# Altium schematic sheet ADC.SchDoc
size A4
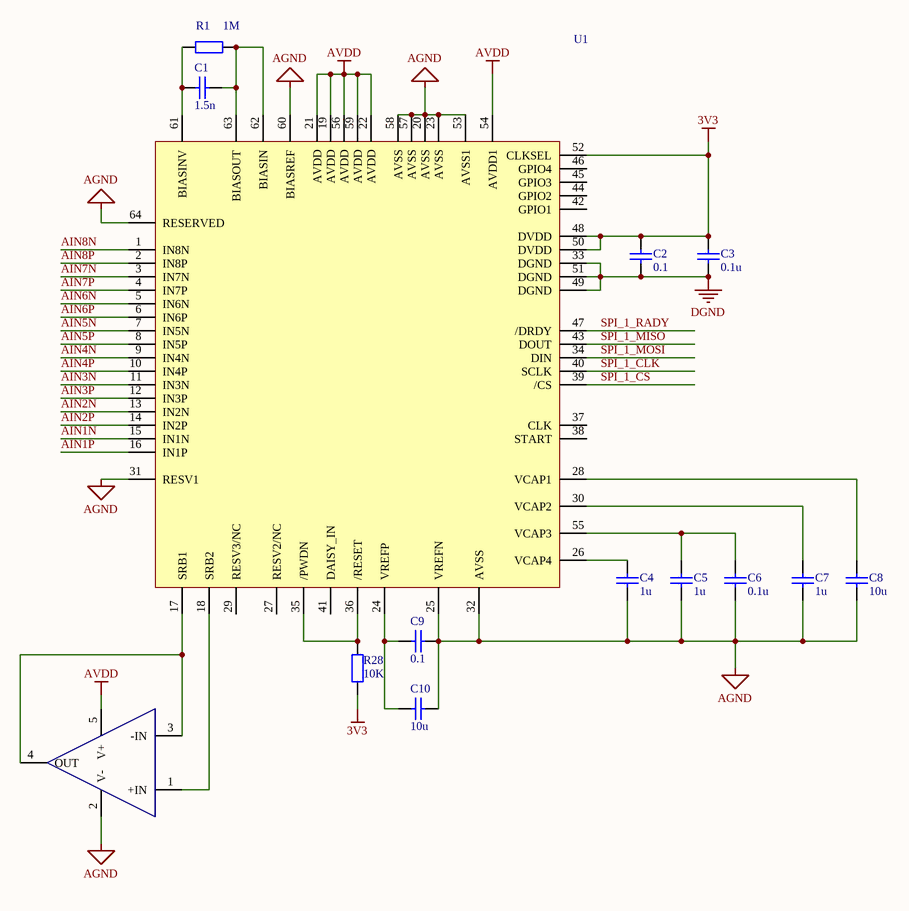
[diagram p0: ADC.SchDoc]

## Parts
?  LTC2054MPS5  [S5]  (value not drawn)
C1  1.5n  [RAD-0.3]
C2  0.1  [CAP-C0603-H0.9mm]
C3  0.1u  [CAP-C0603-H0.9mm]
C4  1u  [CAP-C0603-H0.9mm]
C5  1u  [CAP-C0603-H0.9mm]
C6  0.1u  [CAP-C0603-H0.9mm]
C7  1u  [CAP-C0603-H0.9mm]
C8  10u  [CAP-C0603-H0.9mm]
C9  0.1  [CAP-C0603-H0.9mm]
C10  10u  [CAP-C0603-H0.9mm]
R1  1M  [RES-0805-H0.6mm]
R28  10K  [RES-0805-H0.6mm]
U1  ADS1299  [TQFP-64]  (value not drawn)

## Nets
3V3: C2.1 C3.1 R28.2 U1.48(DVDD) U1.50(DVDD) U1.52(CLKSEL)
AGND: ?.2(V-) C4.2 C5.2 C6.2 C7.2 C8.2 C9.1 C10.1 U1.20(AVSS) U1.23(AVSS) U1.25(VREFN) U1.31(RESV1) U1.32(AVSS) U1.53(AVSS1) U1.57(AVSS) U1.58(AVSS) U1.60(BIASREF) U1.64(RESERVED)
AVDD: ?.5(V+) U1.19(AVDD) U1.21(AVDD) U1.22(AVDD) U1.54(AVDD1) U1.56(AVDD) U1.59(AVDD)
DGND: C2.2 C3.2 U1.33(DGND) U1.49(DGND) U1.51(DGND)
AIN1N: U1.15(IN1N)
AIN1P: U1.16(IN1P)
AIN2N: U1.13(IN2N)
AIN2P: U1.14(IN2P)
AIN3N: U1.11(IN3N)
AIN3P: U1.12(IN3P)
AIN4N: U1.9(IN4N)
AIN4P: U1.10(IN4P)
AIN5N: U1.7(IN5N)
AIN5P: U1.8(IN5P)
AIN6N: U1.5(IN6N)
AIN6P: U1.6(IN6P)
AIN7N: U1.3(IN7N)
AIN7P: U1.4(IN7P)
AIN8N: U1.1(IN8N)
AIN8P: U1.2(IN8P)
SPI_1_CLK: U1.40(SCLK)
SPI_1_CS: U1.39(/CS)
SPI_1_MISO: U1.43(DOUT)
SPI_1_MOSI: U1.34(DIN)
SPI_1_RADY: U1.47(/DRDY)
Net?_1: ?.1(+IN) U1.18(SRB2)
Net?_3: ?.3(-IN) ?.4(OUT) U1.17(SRB1)
NetC1_1: C1.1 R1.2 U1.61(BIASINV)
NetC1_2: C1.2 R1.1 U1.62(BIASIN) U1.63(BIASOUT)
NetC4_1: C4.1 U1.26(VCAP4)
NetC5_1: C5.1 C6.1 U1.55(VCAP3)
NetC7_1: C7.1 U1.30(VCAP2)
NetC8_1: C8.1 U1.28(VCAP1)
NetC9_2: C9.2 C10.2 U1.24(VREFP)
NetR28_1: R28.1 U1.35(/PWDN) U1.36(/RESET)

Not connected (* = marked no-connect by the designer): U1 27(RESV2/NC) 29(RESV3/NC) 37(CLK) 38(START) 41(DAISY_IN) 42(GPIO1) 44(GPIO2) 45(GPIO3) 46(GPIO4)

## Library data of the parts
? = OPA376DCK: IC OPAMP CHOPPER 500KHZ TSOT23-5; Manufacturer: Linear Technology/Analog Devices; Manufacturer Part Number: LTC2054MPS5#TRMPBF; Amplifier Type: Zero-Drift; Output Type: Rail-to-Rail; Slew Rate: 0.5 V/µs; Current - Supply: 145µA; Voltage - Supply, Single/Dual (±): 2.7 V ~ 6 V; Supplier 1: Digi-Key; RoHS: RoHS Compliant; Category: Integrated Circuits (ICs); Stock 1: 929; Pricing 1: 1=13.95, 25=12.454, 100=7.4993, 250=6.87432 (CAD); Packaging: Cut Tape (CT); Part Status: Active; Operating Temperature: -55°C ~ 150°C; Mounting Type: Surface Mount; Package / Case: SOT-23-5 Thin, TSOT-23-5; Supplier Device Package: TSOT-23-5; Base Part Number: LTC2054; ComponentLink1URL: http://www.linear.com/docs/5176; ComponentLink1Description: http://www.linear.com/docs/5176; Supplier Part Number 1: LTC2054MPS5#TRMPBFCT-ND
C1 = Cap: Capacitor
C2-C10 = C0603: CER 10UF 25V X8R 1210; Supplier 1: Digi-Key; Supplier Part Number 1: 445-174833-1-ND; digikey part number: 478-1244-1-ND; Parameter 1: *
R1 R28 = R: RES SMD 33 OHM 1% 1/10W 0603; CMT: 1k; Supplier 1: Digi-Key; Supplier Part Number 1: 311-33.0HRCT-ND
U1 = ADS1299: ComponentLink1Description: EEG BOARD; ComponentLink1URL: https://www.digikey.ca/products/en/development-boards-kits-programmers/evaluation-and-demonstration-boards-and-kits/787?k=ads1299; ComponentLink2Description: ADS1299; ComponentLink2URL: https://www.digikey.ca/product-detail/en/texas-instruments/ADS1299IPAGR/296-34818-1-ND/3536905; digikey: 296-34818-1-ND